# Altium schematic sheet RK3399_PMU.SchDoc
size A4; Date: 07.08.2025; CheckedBy: Own Check; CompanyName: No Company; DocumentNumber: ELK.PCB.0005.0005.A.A; Revision: V0.0.1; SheetNumber: 10; SheetTotal: 22
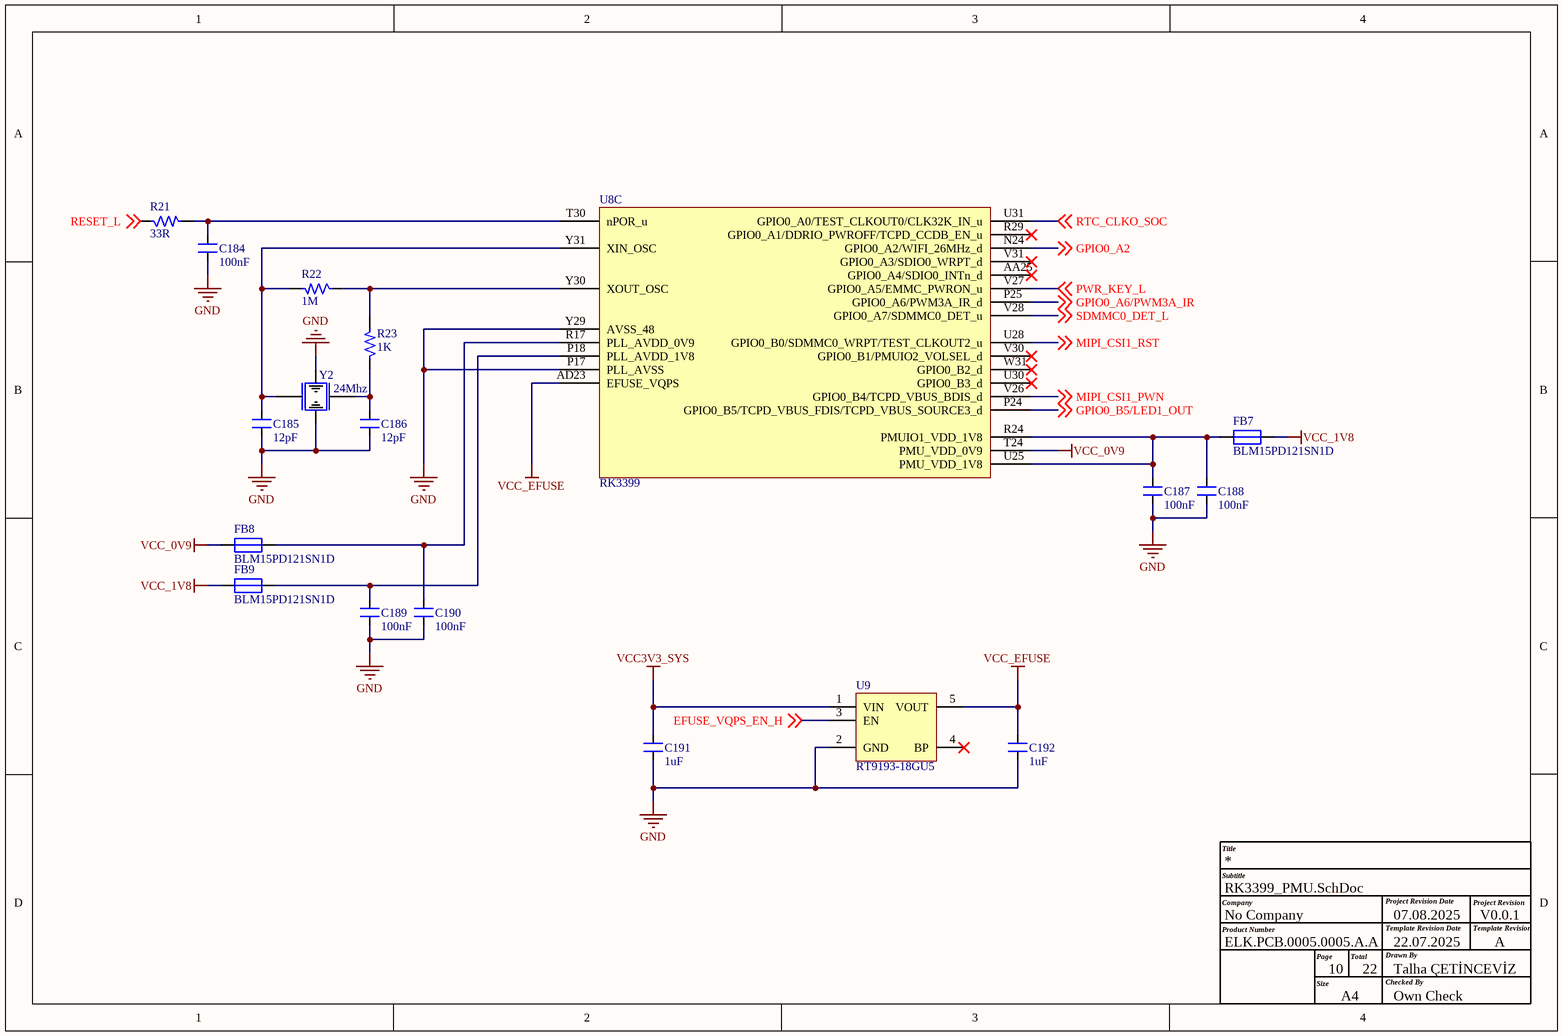
[diagram p0: RK3399_PMU.SchDoc]

## Parts
C184  100nF  [CAP_0201]
C185  12pF  [CAP_0201]
C186  12pF  [CAP_0201]
C187  100nF  [CAP_0201]
C188  100nF  [CAP_0201]
C189  100nF  [CAP_0201]
C190  100nF  [CAP_0201]
C191  1uF  [CAP_0201]
C192  1uF  [CAP_0201]
FB7  BLM15PD121SN1D  [RES_0402]
FB8  BLM15PD121SN1D  [RES_0402]
FB9  BLM15PD121SN1D  [RES_0402]
R21  33R  [RES_0201]
R22  1M  [RES_0201]
R23  1K  [RES_0201]
U8  RK3399  [FBGA828_23_826X826]  (part C of 24)
U9  RT9193-18GU5  [SC70-5]
Y2  24Mhz  [XTAL_ABM8AIG-24.000MHZ-12-2Z-T3]

## Nets
GND: C184.1 C185.1 C186.1 C187.1 C188.1 C189.1 C190.1 C191.1 C192.1 U8.P17(PLL_AVSS) U8.Y29(AVSS_48) U9.2(GND) Y2.2 Y2.4
VCC3V3_SYS: C191.2 U9.1(VIN)
VCC_0V9: FB8.1 U8.T24(PMU_VDD_0V9)
VCC_1V8: FB7.2 FB9.1
VCC_EFUSE: C192.2 U8.AD23(EFUSE_VQPS) U9.5(VOUT)
EFUSE_VQPS_EN_H: U9.3(EN) ; off-sheet EFUSE_VQPS_EN_H
GPIO0_A2: U8.N24(GPIO0_A2/WIFI_26MHz_d) ; off-sheet GPIO0_A2
GPIO0_A6/PWM3A_IR: U8.P25(GPIO0_A6/PWM3A_IR_d) ; off-sheet GPIO0_A6/PWM3A_IR
GPIO0_B5/LED1_OUT: U8.P24(GPIO0_B5/TCPD_VBUS_FDIS/TCPD_VBUS_SOURCE3_d) ; off-sheet GPIO0_B5/LED1_OUT
MIPI_CSI1_PWN: U8.V26(GPIO0_B4/TCPD_VBUS_BDIS_d) ; off-sheet MIPI_CSI1_PWN
MIPI_CSI1_RST: U8.U28(GPIO0_B0/SDMMC0_WRPT/TEST_CLKOUT2_u) ; off-sheet MIPI_CSI1_RST
PWR_KEY_L: U8.V27(GPIO0_A5/EMMC_PWRON_u) ; off-sheet PWR_KEY_L
RESET_L: R21.1 ; off-sheet RESET_L
RTC_CLKO_SOC: U8.U31(GPIO0_A0/TEST_CLKOUT0/CLK32K_IN_u) ; off-sheet RTC_CLKO_SOC
SDMMC0_DET_L: U8.V28(GPIO0_A7/SDMMC0_DET_u) ; off-sheet SDMMC0_DET_L
NetC184_2: C184.2 R21.2 U8.T30(nPOR_u)
NetC185_2: C185.2 R22.2 U8.Y31(XIN_OSC) Y2.1
NetC186_2: C186.2 R23.1 Y2.3
NetC187_2: C187.2 C188.2 FB7.1 U8.R24(PMUIO1_VDD_1V8) U8.U25(PMU_VDD_1V8)
NetC189_2: C189.2 FB9.2 U8.P18(PLL_AVDD_1V8)
NetC190_2: C190.2 FB8.2 U8.R17(PLL_AVDD_0V9)
NetR22_1: R22.1 R23.2 U8.Y30(XOUT_OSC)

Not connected (* = marked no-connect by the designer): U8 AA25(GPIO0_A4/SDIO0_INTn_d)* R29(GPIO0_A1/DDRIO_PWROFF/TCPD_CCDB_EN_u)* U30(GPIO0_B3_d)* V30(GPIO0_B1/PMUIO2_VOLSEL_d)* V31(GPIO0_A3/SDIO0_WRPT_d)* W31(GPIO0_B2_d)*; U9 4(BP)*

## Notes on the sheet
- Title
- Company
- Product Number
- Subtitle
- Project Revision Date
- Template Revision Date
- Project Revision
- Template Revision
- Size
- Page
- A4
- Total
- Checked By
- Drawn By
- 22.07.2025
- Talha ÇETİNCEVİZ
- A

## Library data of the parts
C184 C187-C190 = CAP_100nF-25V-10%-0201: 0.1µF ±10% 25V Ceramic Capacitor X5R 0201 (0603 Metric); Manufacturer: TDK Corporation; Manufacturer Part Number: C0603X5R1E104K030BB; Case/Package: 0201; Supplier-1: Digikey
C185 C186 = CAP_12pF-16V-10%-0201: 12pF ±10% 16V Ceramic Capacitor C0G, NP0 0201 (0603 Metric); Manufacturer: AVX Corporation; Manufacturer Part Number: 0201YA120KAT2A; Case/Package: 0201; Supplier-1: Digikey
C191 C192 = CAP_1uF-16V-10%-0201: 1µF ±20% 16V Ceramic Capacitor X5R 0201 (0603 Metric); Manufacturer: Samsung Electro-Mechanics; Manufacturer Part Number: CL03A105MO3NRNH; Case/Package: 0201; Supplier-1: Digikey
FB7-FB9 = FB_120R-1.3A-100Mhz-0402: 120 Ohms @ 100MHz 1 Power Line Ferrite Bead 0402 (1005 Metric) 1.3A 90mOhm; Manufacturer: Murata Electronics; Mnaufacturer Part Number: BLM15PD121SN1D; Case/Package: 0402; Supplier-1: Digikey
R21 = RES_33R-0.05W-1%-0201: 33 Ohms ±1% 0.05W, 1/20W Chip Resistor 0201 (0603 Metric) Thick Film; Manufacturer: Yageo; Manufacturer Part Number: RC0201FR-0733RL; Case/Package: 0201; Supplier-1: Digikey
R22 = RES_1M-0.05W-1%-0201: 1 MOhms ±1% 0.05W, 1/20W Chip Resistor 0201 (0603 Metric) Thick Film; Manufacturer: Yageo; Manufacturer Part Number: RC0201FR-071ML; Case/Package: 0201; Supplier-1: Digikey
R23 = RES_1K-0.05W-1%-0201: 1 kOhms ±1% 0.05W, 1/20W Chip Resistor 0201 (0603 Metric) Thick Film; Manufacturer: Yageo; Manufacturer Part Number: RC0201FR-071KL; Case/Package: 0201; Supplier-1: Digikey
U8 = IC_RK3399-FCBGA828: RK3399 is a low power, high performance processor for computing, personal mobile.; Manufacturer: Rockchip; Manufacturer Part Number: RK3399; Case/Package: FCBGA828; Supplier-1: Rockchip
U9 = REG_1.8V-300mA-5.5V-SC70-5: Linear Voltage Regulator IC 1 Output 300mA SC-70-5; Manufacturer: Richtek USA Inc.; Manufacturer Part Number: RT9193-18GU5; Case/Package: SC70-5; Supplier-1: Digikey
Y2 = XTAL_24Mhz-12pF-4-SMD: 24MHz ±20ppm Crystal 12pF 50 Ohms 4-SMD, No Lead; Manufacturer: Abracon LLC; Manufacturer Part Number: ABM8AIG-24.000MHZ-12-2Z-T3; Case/Package: SMD; Supplier-1: Digikey